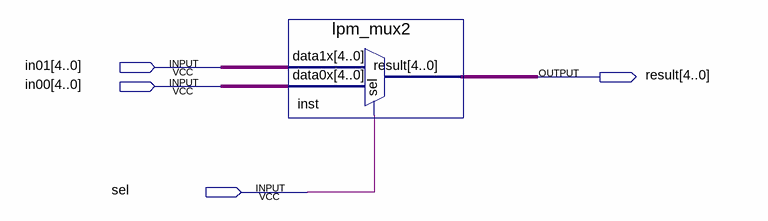
[diagram p0: schematic sheet]
// Quartus schematic MUX_5.bdf as structural Verilog: 1 symbols, 4 pins
module MUX_5 (
  input  [4:0] in01,
  input  [4:0] in00,
  input  sel,
  output [4:0] result
);

  lpm_mux2 inst (.data1x(in01), .data0x(in00), .sel(sel), .result(result));
endmodule
